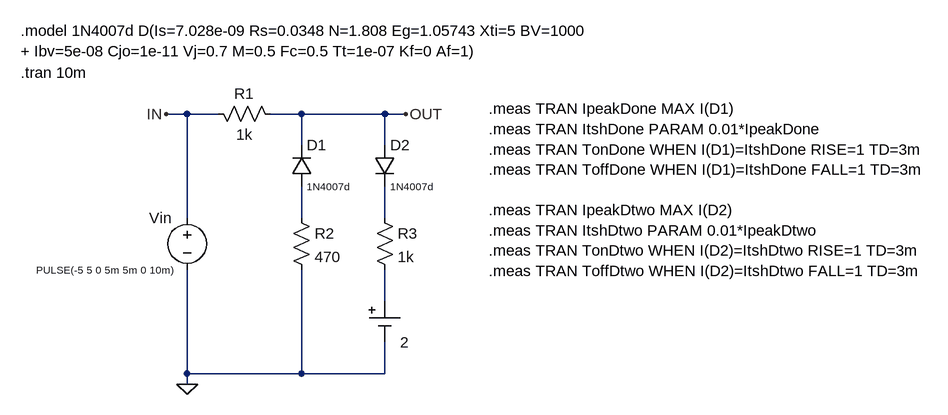
[diagram p0: schematic experiment-1.asc]
experiment-1.asc, the LTspice schematic file:
Version 4.1
SHEET 1 1860 680
WIRE 672 64 640 64
WIRE 720 64 672 64
WIRE 848 64 800 64
WIRE 976 64 848 64
WIRE 1008 64 976 64
WIRE 848 112 848 64
WIRE 976 112 976 64
WIRE 672 224 672 64
WIRE 848 224 848 176
WIRE 976 224 976 176
WIRE 976 352 976 304
WIRE 672 464 672 304
WIRE 848 464 848 304
WIRE 848 464 672 464
WIRE 976 464 976 416
WIRE 976 464 848 464
WIRE 672 480 672 464
FLAG 672 480 0
FLAG 1008 64 OUT
FLAG 640 64 IN
SYMBOL voltage 672 208 M0
WINDOW 123 0 0 Left 0
WINDOW 39 0 0 Left 0
WINDOW 3 24 96 Left 1
SYMATTR Value PULSE(-5 5 0 5m 5m 0 10m)
SYMATTR InstName Vin
SYMBOL res 704 48 M90
WINDOW 0 0 56 VBottom 2
WINDOW 3 32 56 VTop 2
SYMATTR InstName R1
SYMATTR Value 1k
SYMBOL diode 960 112 R0
WINDOW 3 24 64 Left 1
SYMATTR Value 1N4007d
SYMATTR InstName D2
SYMBOL diode 832 176 M180
WINDOW 0 24 64 Left 2
WINDOW 3 24 0 Left 1
SYMATTR InstName D1
SYMATTR Value 1N4007d
SYMBOL res 832 208 R0
SYMATTR InstName R2
SYMATTR Value 470
SYMBOL res 960 208 R0
SYMATTR InstName R3
SYMATTR Value 1k
SYMBOL Misc\\cell 976 352 R0
WINDOW 0 24 8 Invisible 2
SYMATTR InstName V1
SYMATTR Value 2
TEXT 416 0 Left 2 !.tran 10m
TEXT 416 -64 Left 2 !.model 1N4007d D(Is=7.028e-09 Rs=0.0348 N=1.808 Eg=1.05743 Xti=5 BV=1000\n+ Ibv=5e-08 Cjo=1e-11 Vj=0.7 M=0.5 Fc=0.5 Tt=1e-07 Kf=0 Af=1)
TEXT 1136 56 Left 2 !.meas TRAN IpeakDone MAX I(D1)\n.meas TRAN ItshDone PARAM 0.01*IpeakDone\n.meas TRAN TonDone WHEN I(D1)=ItshDone RISE=1 TD=3m\n.meas TRAN ToffDone WHEN I(D1)=ItshDone FALL=1 TD=3m\n \n.meas TRAN IpeakDtwo MAX I(D2)\n.meas TRAN ItshDtwo PARAM 0.01*IpeakDtwo\n.meas TRAN TonDtwo WHEN I(D2)=ItshDtwo RISE=1 TD=3m\n.meas TRAN ToffDtwo WHEN I(D2)=ItshDtwo FALL=1 TD=3m

The netlist it stands for:
* experiment-1.asc
Vin IN 0 PULSE(-5 5 0 5m 5m 0 10m)
R1 IN OUT 1k
D2 OUT N002 1N4007d
D1 N001 OUT 1N4007d
R2 N001 0 470
R3 N002 N003 1k
V1 N003 0 2
.model D D
.lib standard.dio
.tran 10m
.model 1N4007d D(Is=7.028e-09 Rs=0.0348 N=1.808 Eg=1.05743 Xti=5 BV=1000
+ Ibv=5e-08 Cjo=1e-11 Vj=0.7 M=0.5 Fc=0.5 Tt=1e-07 Kf=0 Af=1)
.meas TRAN IpeakDone MAX I(D1)
.meas TRAN ItshDone PARAM 0.01*IpeakDone
.meas TRAN TonDone WHEN I(D1)=ItshDone RISE=1 TD=3m
.meas TRAN ToffDone WHEN I(D1)=ItshDone FALL=1 TD=3m
.meas TRAN IpeakDtwo MAX I(D2)
.meas TRAN ItshDtwo PARAM 0.01*IpeakDtwo
.meas TRAN TonDtwo WHEN I(D2)=ItshDtwo RISE=1 TD=3m
.meas TRAN ToffDtwo WHEN I(D2)=ItshDtwo FALL=1 TD=3m
.backanno
.end